# EAGLE schematic Rapide13 (EAGLE 6.3)
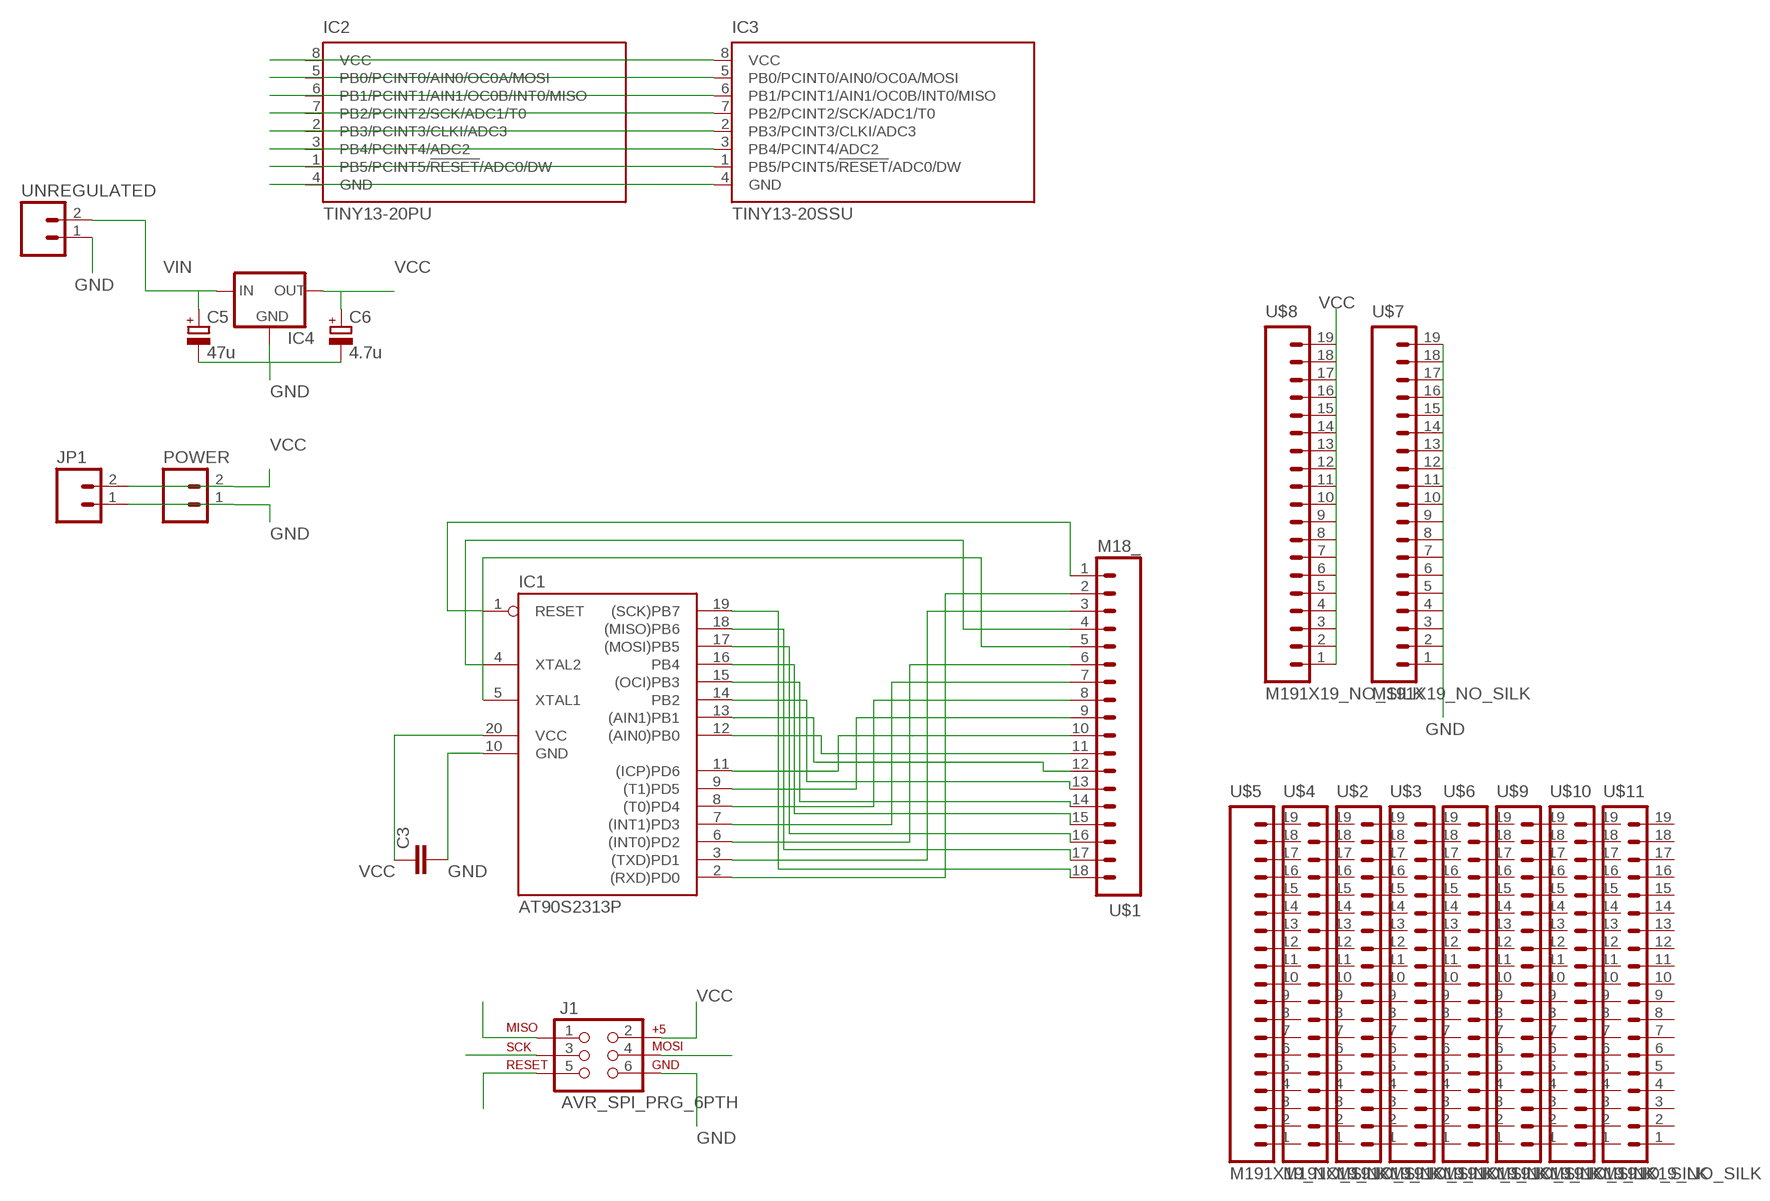
[diagram p0: schematic, sheet 1]

## Parts
C3  C-EU025-024X044  [C025-024X044]
C5  47u  CPOL-EUE2,5-6E  [E2,5-6E]
C6  4.7u  CPOL-EUE2,5-6E  [E2,5-6E]
IC1  AT90S2313P  [DIL20]
IC2  TINY13-20PU  [DIL08]
IC3  TINY13-20SSU  [8S1]
IC4  78XXS  [78XXS]
J1  AVR_SPI_PRG_6PTH  [2X3]
JP1  M02PTH  [1X02]
POWER  M02LOCK_LONGPADS  [1X02_LOCK_LONGPADS]
U$1  M18_  [1X18]
U$2  M191X19_NO_SILK  [1X19_NO_SILK]
U$3  M191X19_NO_SILK  [1X19_NO_SILK]
U$4  M191X19_NO_SILK  [1X19_NO_SILK]
U$5  M191X19_NO_SILK  [1X19_NO_SILK]
U$6  M191X19_NO_SILK  [1X19_NO_SILK]
U$7  M191X19_NO_SILK  [1X19_NO_SILK]
U$8  M191X19_NO_SILK  [1X19_NO_SILK]
U$9  M191X19_NO_SILK  [1X19_NO_SILK]
U$10  M191X19_NO_SILK  [1X19_NO_SILK]
U$11  M191X19_NO_SILK  [1X19_NO_SILK]
UNREGULATED  M02PTH3  [1X02_LONGPADS]

## Nets
GND: C3.2 C5.- C6.- IC1.10(GND) IC2.4(GND) IC3.4(GND) IC4.GND J1.6 JP1.1 POWER.1 U$7.1 U$7.2 U$7.3 U$7.4 U$7.5 U$7.6 U$7.7 U$7.8 U$7.9 U$7.10 U$7.11 U$7.12 U$7.13 U$7.14 U$7.15 U$7.16 U$7.17 U$7.18 U$7.19 UNREGULATED.1
MISO: IC1.18((MISO)PB6) IC2.6(PB1/PCINT1/AIN1/OC0B/INT0/MISO) IC3.6(PB1/PCINT1/AIN1/OC0B/INT0/MISO) J1.1 U$1.17
MOSI: IC1.17((MOSI)PB5) IC2.5(PB0/PCINT0/AIN0/OC0A/MOSI) IC3.5(PB0/PCINT0/AIN0/OC0A/MOSI) J1.4 U$1.16
N$1: IC1.4(XTAL2) U$1.4
N$2: IC1.5(XTAL1) U$1.5
N$3: IC1.2((RXD)PD0) U$1.2
N$4: IC1.3((TXD)PD1) U$1.3
N$5: IC1.6((INT0)PD2) U$1.6
N$6: IC1.7((INT1)PD3) U$1.7
N$7: IC1.8((T0)PD4) U$1.8
N$8: IC1.9((T1)PD5) U$1.9
N$9: IC1.11((ICP)PD6) U$1.10
N$10: IC1.12((AIN0)PB0) U$1.11
N$11: IC1.13((AIN1)PB1) U$1.12
N$12: IC1.14(PB2) U$1.13
RESET: IC1.1(RESET) IC2.1(PB5/PCINT5/!RESET!/ADC0/DW) IC3.1(PB5/PCINT5/!RESET!/ADC0/DW) J1.5 U$1.1
SCK: IC1.19((SCK)PB7) IC2.7(PB2/PCINT2/SCK/ADC1/T0) IC3.7(PB2/PCINT2/SCK/ADC1/T0) J1.3 U$1.18
TINY13_B3: IC1.15((OCI)PB3) IC2.2(PB3/PCINT3/CLKI/ADC3) IC3.2(PB3/PCINT3/CLKI/ADC3) U$1.14
TINY13_B4: IC1.16(PB4) IC2.3(PB4/PCINT4/ADC2) IC3.3(PB4/PCINT4/ADC2) U$1.15
VCC: C3.1 C6.+ IC1.20(VCC) IC2.8(VCC) IC3.8(VCC) IC4.OUT J1.2 JP1.2 POWER.2 U$8.1 U$8.2 U$8.3 U$8.4 U$8.5 U$8.6 U$8.7 U$8.8 U$8.9 U$8.10 U$8.11 U$8.12 U$8.13 U$8.14 U$8.15 U$8.16 U$8.17 U$8.18 U$8.19
VIN: C5.+ IC4.IN UNREGULATED.2
Unconnected: U$2.1 U$2.2 U$2.3 U$2.4 U$2.5 U$2.6 U$2.7 U$2.8 U$2.9 U$2.10 U$2.11 U$2.12 U$2.13 U$2.14 U$2.15 U$2.16 U$2.17 U$2.18 U$2.19 U$3.1 U$3.2 U$3.3 U$3.4 U$3.5 U$3.6 U$3.7 U$3.8 U$3.9 U$3.10 U$3.11 U$3.12 U$3.13 U$3.14 U$3.15 U$3.16 U$3.17 U$3.18 U$3.19 U$4.1 U$4.2 U$4.3 U$4.4 U$4.5 U$4.6 U$4.7 U$4.8 U$4.9 U$4.10 U$4.11 U$4.12 U$4.13 U$4.14 U$4.15 U$4.16 U$4.17 U$4.18 U$4.19 U$5.1 U$5.2 U$5.3 U$5.4 U$5.5 U$5.6 U$5.7 U$5.8 U$5.9 U$5.10 U$5.11 U$5.12 U$5.13 U$5.14 U$5.15 U$5.16 U$5.17 U$5.18 U$5.19 U$6.1 U$6.2 U$6.3 U$6.4 U$6.5 U$6.6 U$6.7 U$6.8 U$6.9 U$6.10 U$6.11 U$6.12 U$6.13 U$6.14 U$6.15 U$6.16 U$6.17 U$6.18 U$6.19 U$9.1 U$9.2 U$9.3 U$9.4 U$9.5 U$9.6 U$9.7 U$9.8 U$9.9 U$9.10 U$9.11 U$9.12 U$9.13 U$9.14 U$9.15 U$9.16 U$9.17 U$9.18 U$9.19 U$10.1 U$10.2 U$10.3 U$10.4 U$10.5 U$10.6 U$10.7 U$10.8 U$10.9 U$10.10 U$10.11 U$10.12 U$10.13 U$10.14 U$10.15 U$10.16 U$10.17 U$10.18 U$10.19 U$11.1 U$11.2 U$11.3 U$11.4 U$11.5 U$11.6 U$11.7 U$11.8 U$11.9 U$11.10 U$11.11 U$11.12 U$11.13 U$11.14 U$11.15 U$11.16 U$11.17 U$11.18 U$11.19

## Library data of the parts
C3 = resistor:C-EU: CAPACITOR, European symbol
C5 C6 = resistor:CPOL-EU: POLARIZED CAPACITOR, European symbol
IC1 = atmel:AT90S2313: MICROCONTROLLER 2 Kbytes FLASH 128 bytes SRAM 128 bytes EEPROM UART; OC_FARNELL: unknown; OC_NEWARK: unknown
IC2 = atmel:TINY13: 8-bit AVR Microcontroller with 1K Bytes In-System Programmable Flash Source: http://www.atmel.com/dyn/resources/prod_documents/2535S.pdf; MPN: ATTINY13-20PU; OC_FARNELL: 9171550; OC_NEWARK: 96K6521
IC3 = atmel:TINY13: 8-bit AVR Microcontroller with 1K Bytes In-System Programmable Flash Source: http://www.atmel.com/dyn/resources/prod_documents/2535S.pdf; MPN: ATTINY13-20SSU; OC_FARNELL: 1455133; OC_NEWARK: 58M3771
IC4 = v-reg:78XXS: VOLTAGE REGULATOR
J1 = SparkFun:AVR_SPI_PRG_6: AVR ISP 6 Pin This is the reduced ISP connector for AVR programming. Common on Arduino. This footprint will take up less PCB space and can be used with a 10-pin to 6-pin adapter such as SKU: BOB-08508
JP1 = SparkFun-Connectors:M02: Header 2 Standard 2-pin 0.1" header. Use with straight break away headers (SKU : PRT-00116), right angle break away headers (PRT-00553), swiss pins (PRT-00743), machine pins (PRT-00117), and female headers (PRT-00115). Molex polarized connector foot print use with SKU : PRT-08233 with associated crimp pins and housings.
POWER UNREGULATED = SparkFun:M02: Header 2 Standard 2-pin 0.1" header. Use with straight break away headers (SKU : PRT-00116), right angle break away headers (PRT-00553), swiss pins (PRT-00743), machine pins (PRT-00117), and female headers (PRT-00115). Molex polarized connector foot print use with SKU : PRT-08233 with associated crimp pins and housings.
U$1 = SparkFun:M18
U$2-U$11 = SparkFun-Connectors:M19: 1x19 .1" header